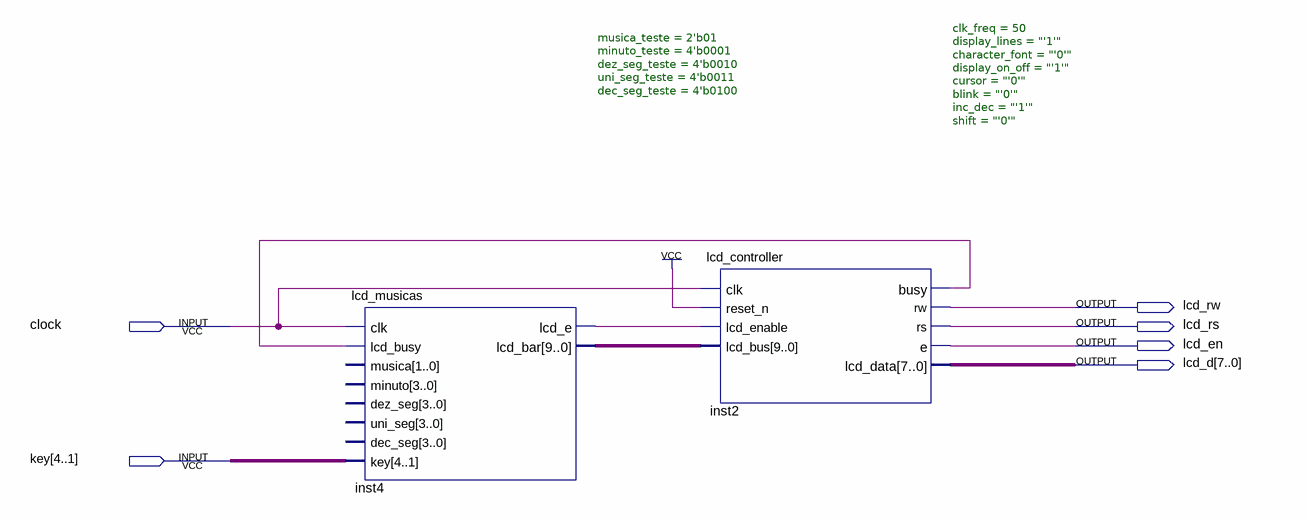
[diagram p0: schematic sheet]
// Quartus schematic Block1.bdf as structural Verilog: 2 symbols, 6 pins
module Block1 (
  input  clock,
  input  [4:1] key,
  output lcd_rw,
  output lcd_rs,
  output lcd_en,
  output [7:0] lcd_d
);

  wire inst2_busy, inst4_lcd_e;
  wire [9:0] inst4_lcd_bar;

  lcd_musicas #(.musica_teste(2'b01), .minuto_teste(4'b0001), .dez_seg_teste(4'b0010), .uni_seg_teste(4'b0011), .dec_seg_teste(4'b0100)) inst4 (
    .clk(clock), .lcd_busy(inst2_busy), .key(key), .lcd_e(inst4_lcd_e), .lcd_bar(inst4_lcd_bar));  // open: musica, minuto, dez_seg, uni_seg, dec_seg
  lcd_controller #(.clk_freq(50), .display_lines("'1'"), .character_font("'0'"), .display_on_off("'1'"), .cursor("'0'"), .blink("'0'"), .inc_dec("'1'"), .shift("'0'")) inst2 (
    .clk(clock), .reset_n(1'b1), .lcd_enable(inst4_lcd_e), .lcd_bus(inst4_lcd_bar), .busy(inst2_busy),
    .rw(lcd_rw), .rs(lcd_rs), .e(lcd_en), .lcd_data(lcd_d));
endmodule
